# EAGLE design ActiveHeadphone2 (EAGLE 6.2)
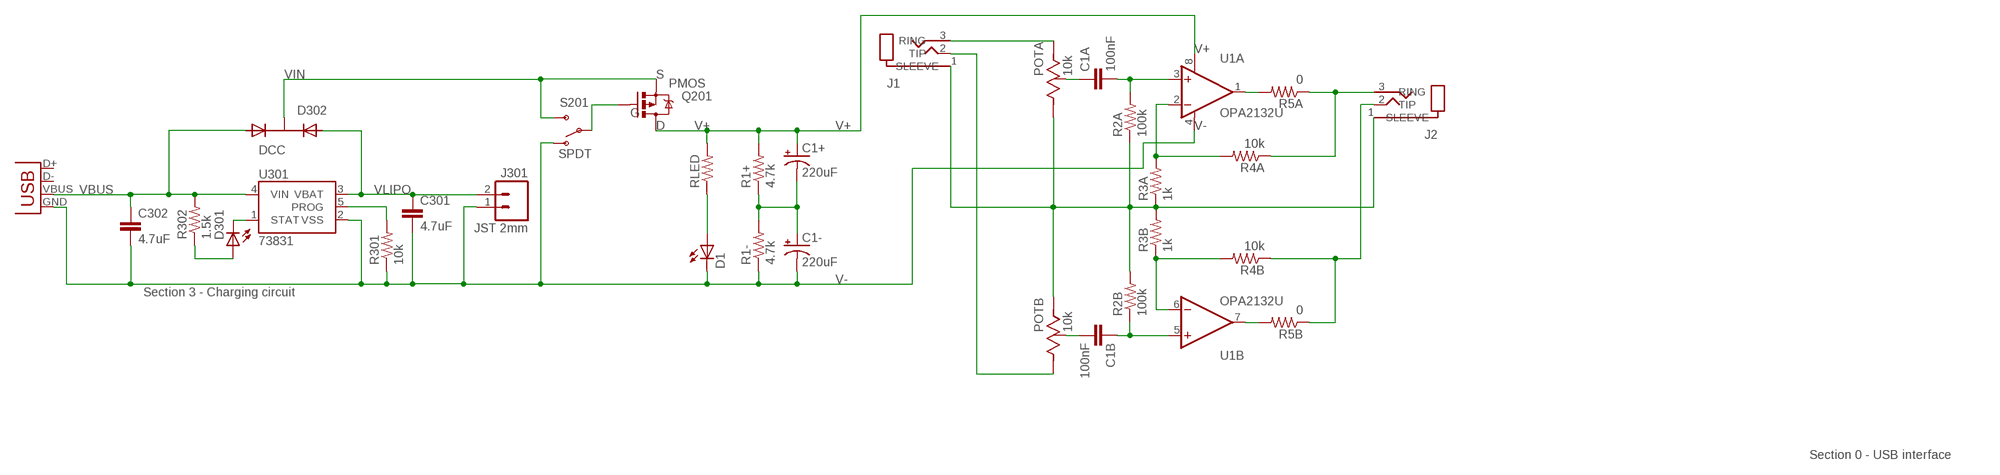
[diagram p0: schematic, sheet 1]

## Parts
C1+  220uF  CAP_POL7343  [EIA7343]
C1-  220uF  CAP_POL7343  [EIA7343]
C1A  100nF  CAP0603-CAP  [0603-CAP]
C1B  100nF  CAP0603-CAP  [0603-CAP]
C301  4.7uF  CAP0603-CAP  [0603-CAP]
C302  4.7uF  CAP0603-CAP  [0603-CAP]
D1  RED  LED0603  [LED-0603]
D301  RED  LED0603  [LED-0603]
D302  DCC  PMEG2005CT  [SOT-23-3]
J1  3.5mm  SJ1-3513-SMT  [SJ1-3513-SMT]
J2  3.5mm  SJ1-3513-SMT  [SJ1-3513-SMT]
J003  USBSMD  [USB-MINIB]
J301  JST 2mm  M02-JST-2MM-SMT  [JST-2-SMD]
POTA  10k  3352T  [3352T]
POTB  10k  3352T  [3352T]
Q201  PMOS  MOSFET-PCHANNELSMD  [SOT23-3]
R1+  4.7k  RESISTOR0603-RES  [0603-RES]
R1-  4.7k  RESISTOR0603-RES  [0603-RES]
R2A  100k  RESISTOR0603-RES  [0603-RES]
R2B  100k  RESISTOR0603-RES  [0603-RES]
R3A  1k  RESISTOR0603-RES  [0603-RES]
R3B  1k  RESISTOR0603-RES  [0603-RES]
R4A  10k  RESISTOR0603-RES  [0603-RES]
R4B  10k  RESISTOR0603-RES  [0603-RES]
R5A  0  RESISTOR0603-RES  [0603-RES]
R5B  0  RESISTOR0603-RES  [0603-RES]
R301  10k  RESISTOR0603-RES  [0603-RES]
R302  1.5k  RESISTOR0603-RES  [0603-RES]
RLED  RESISTOR0603-RES  [0603-RES]
S201  SPDT  SWITCH-SPSTSMD  [AYZ0202]
U1  OPA2132U  [SO08]
U301  73831  MCP73831  [SOT23-5]

## Nets
N$1: C1A.2 R2A.2 U1.3(A:+IN)
N$2: D1.A RLED.1
N$3: J2.3(RING) R4A.1 R5A.1
N$4: J1.3(RING) POTA.3(CW)
N$5: C1A.1 POTA.2(WIPER)
N$6: R5A.2 U1.1(A:OUT)
N$7: R3A.2 R4A.2 U1.2(A:-IN)
N$8: J1.2(TIP) POTB.1(CCW)
N$9: C1B.2 POTB.2(WIPER)
N$10: C1B.1 R2B.1 U1.5(B:+IN)
N$11: R3B.1 R4B.2 U1.6(B:-IN)
N$12: R5B.2 U1.7(B:OUT)
N$13: J2.2(TIP) R4B.1 R5B.1
N$14: R301.2 U301.5(PROG)
N$15: C1+.C(-) C1-.A(+) R1+.1 R1-.2
N$16: Q201.1(G) S201.2(P)
N$18: D301.A R302.1
N$19: D301.C U301.1(STAT)
V+: C1+.A(+) Q201.3(D) R1+.2 RLED.2 U1.8(A:V+)
V-: C1-.C(-) C301.2 C302.2 D1.C J003.GND J301.1 R1-.1 R301.1 S201.1(O) U1.4(A:V-) U301.2(VSS)
VBUS [power]: C302.1 D302.1(A1) J003.VBUS R302.2 U301.4(VIN)
VGND: J1.1(SLEEVE) J2.1(SLEEVE) POTA.1(CCW) POTB.3(CW) R2A.1 R2B.2 R3A.1 R3B.2
VIN: D302.3(K) Q201.2(S) S201.3(S)
VLIPO [power]: C301.1 D302.2(A2) J301.2 U301.3(VBAT)
Unconnected: J003.D+ J003.D-

## Notes on the sheet
- S
- G
- D
- Section 3 - Charging circuit
- Section 0 - USB interface

## Library data of the parts
C1+ C1- = SparkFun:CAP_POL: Capacitor Polarized These are standard SMD and PTH capacitors. Normally 10uF, 47uF, and 100uF in electrolytic and tantalum varieties. Always verify the external diameter of the through hole cap, it varies with capacity, voltage, and manufacturer. The EIA devices should be standard.; DIGIKEY: 399-5124-1-ND
C1A C1B C301 C302 = SparkFun:CAP: Capacitor Standard 0603 ceramic capacitor, and 0.1" leaded capacitor.
D1 D301 = SparkFun:LED: LEDs Standard schematic elements and footprints for 5mm, 3mm, 1206, and 0603 sized LEDs. 5mm - Spark Fun Electronics SKU : COM-00529 (and others)
D302 = KwanSystems:PMEG2005CT
J1 J2 = KwanSystems:SJ1-3513-SMT
J003 = SparkFun:USB: USB Connectors USB-B-PTH is fully proven SKU : PRT-00139 USB-miniB is fully proven SKU : PRT-00587 USB-A-PCB is untested. USB-A-H is throughly reviewed, but untested. Spark Fun Electronics SKU : PRT-00437 USB-B-SMT is throughly reviewed, but untested. Needs silkscreen touching up. USB-A-S has not been used/tested USB-MB-H has not been used/tested
J301 = SparkFun:M02: Header 2 Standard 2-pin 0.1" header. Use with straight break away headers (SKU : PRT-00116), right angle break away headers (PRT-00553), swiss pins (PRT-00743), machine pins (PRT-00117), and female headers (PRT-00115). Molex polarized connector foot print use with SKU : PRT-08233 with associated crimp pins and housings.
POTA POTB = KwanSystems:3352T
Q201 = SparkFun:MOSFET-PCHANNEL
R1+ R1- R2A R2B R3A R3B R4A R4B R5A R5B R301 R302 RLED = SparkFun:RESISTOR: Resistor Basic schematic elements and footprints for 0603, 1206, and PTH resistors.
S201 = SparkFun:SWITCH-SPST: SPST Switch Simple slide switch. Spark Fun Electronics SKU : COM-00102
U1 = burr-brown:OPA2132: High Speed FET-Input Operational Amplifiers< Product Folder:OPA2132; MF: TEXAS INSTRUMENTS; MPN: OPA2132U; OC_FARNELL: 1206934; OC_NEWARK: 80K6015
U301 = SparkFun:MCP73831: Microchip's MCP73831 Miniature single cell, fully integrated Li-Ion, Li-polymer charge management controller http://ww1.microchip.com/downloads/en/DeviceDoc/21984a.pdf

## Net classes
0 default: width 0.152 mm, drill 0.33 mm, clearance 0.152 mm
1 power: width 0.152 mm, drill 0.33 mm, clearance 0.152 mm to class 0, clearance 0.152 mm

## Board
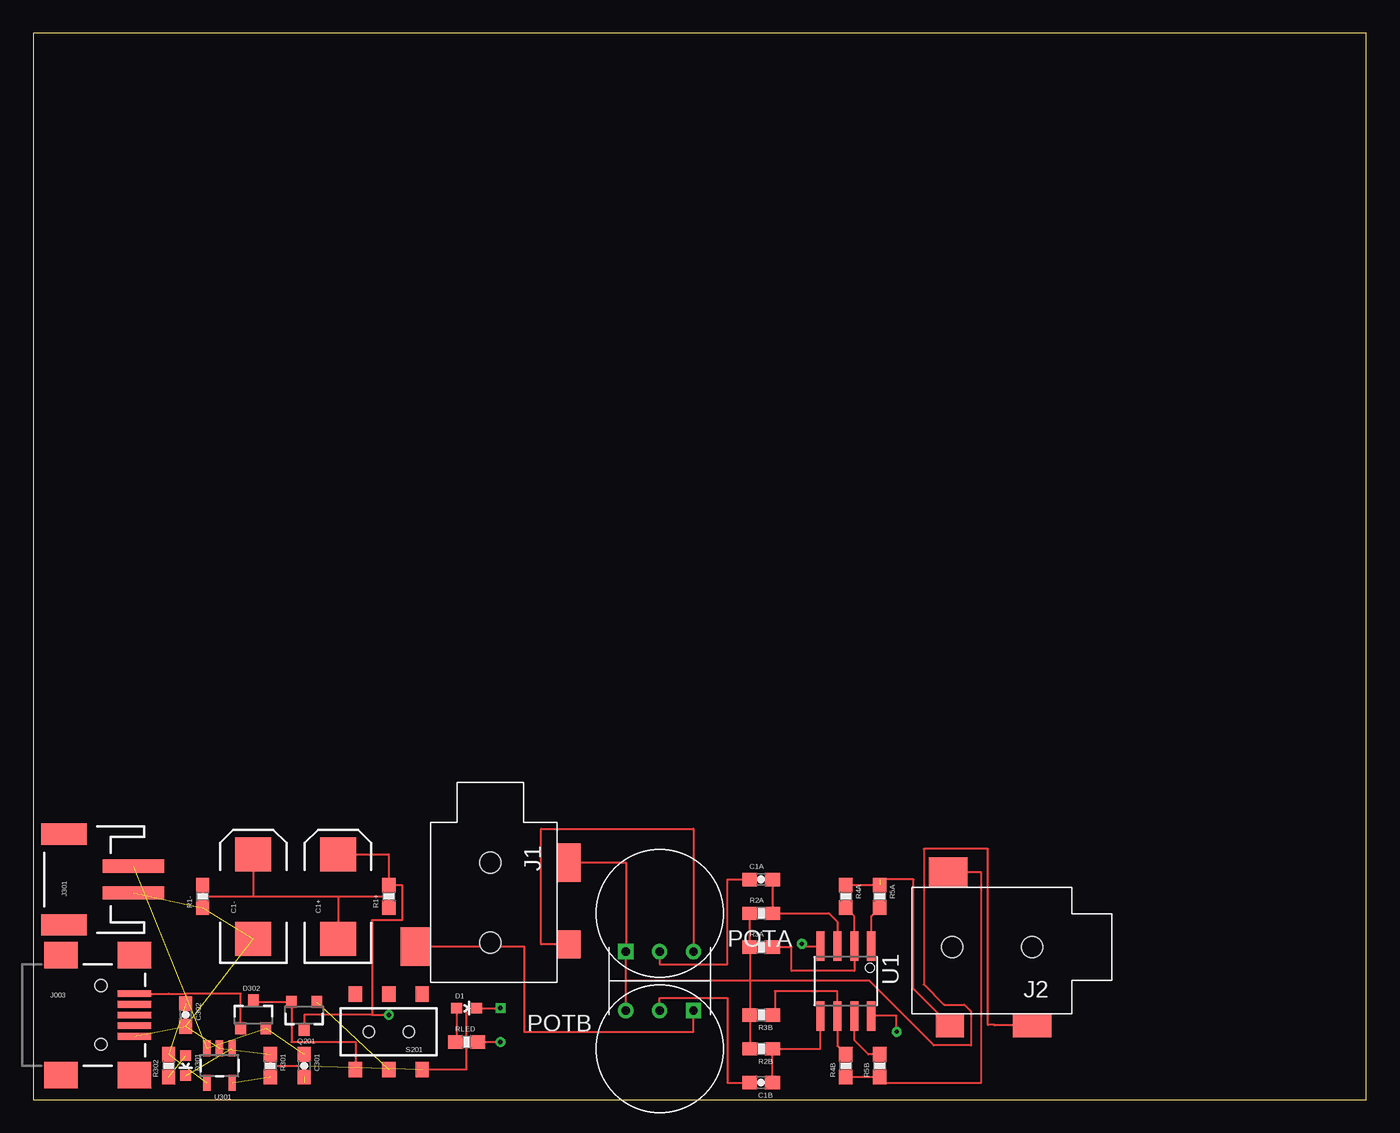
[diagram p1: board, top side]
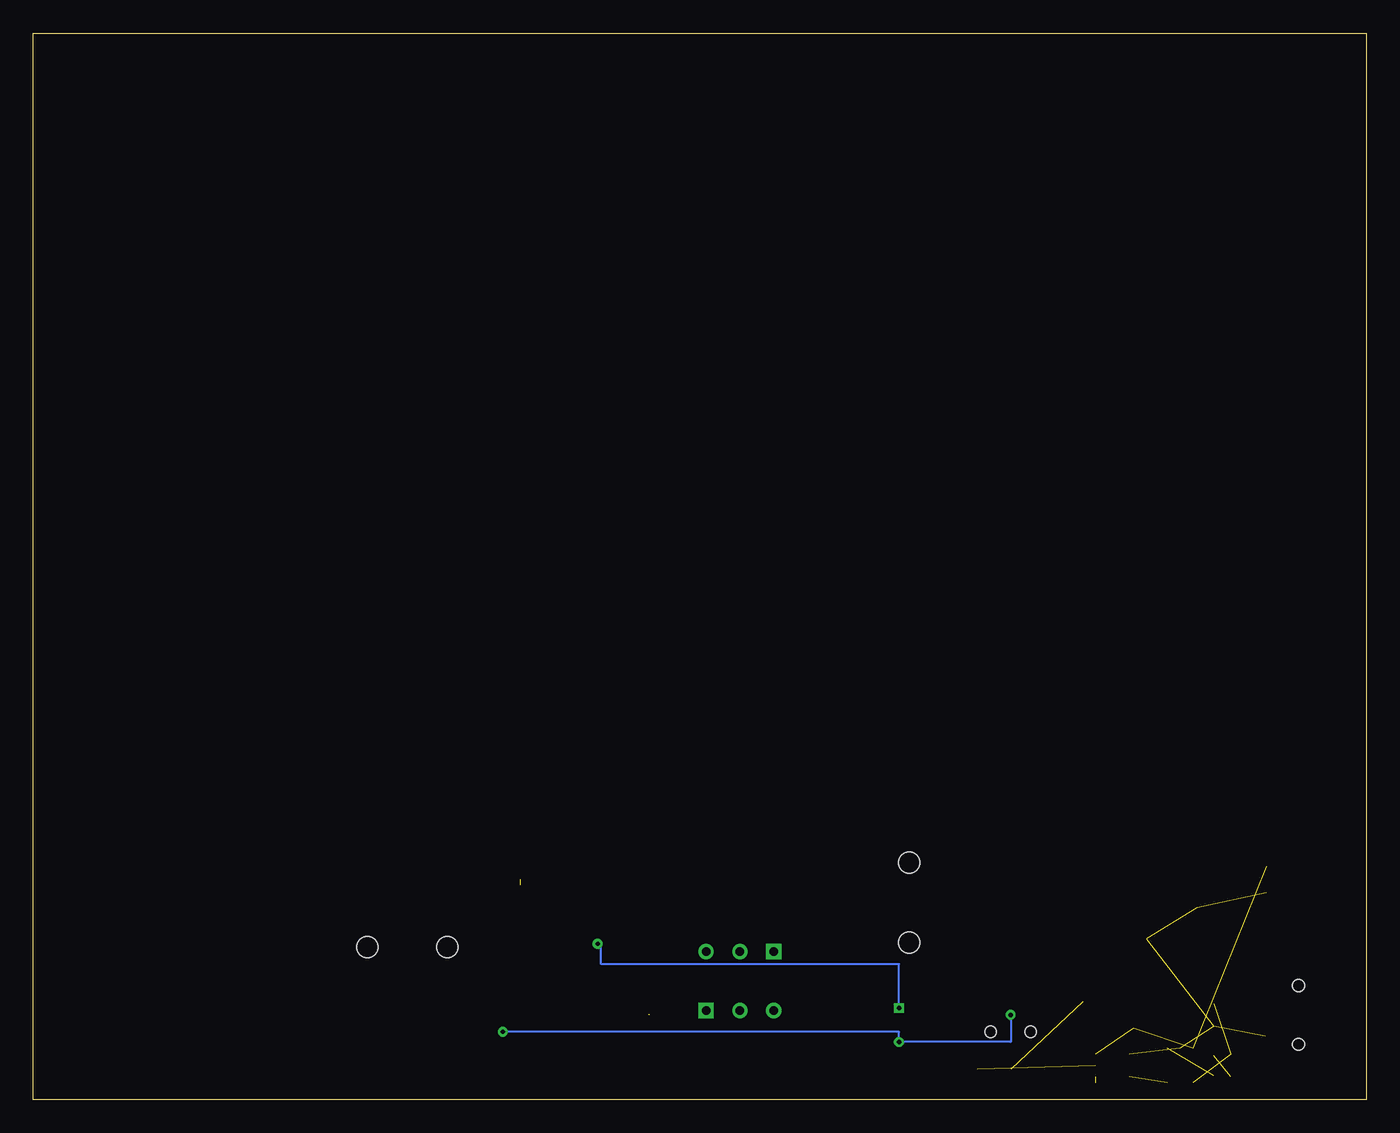
[diagram p2: board, bottom side, seen from below]

Size 100 x 80 mm. Coordinates in mm from the lower left corner, seen from the top.
Outline: 0,0 100,0 100,80 0,80 0,0
Copper layers (1*16): Top 0.035mm / dielectric 1.5mm / Bottom 0.035mm
Design rules: minimum track width 10mil, minimum drill 24mil, track to track 8mil, track to pad 8mil, pad to pad 8mil, via to via 8mil, smd to smd 8mil, copper to edge 40mil, drill to drill 8mil, minimum pad ring 10mil, minimum via ring 8mil, stop-mask expansion 4mil, vias tented up to drill 0mil, thermal gap 10mil

### Footprints (pad centres in the part's own frame; a part is rotated, then mirrored left to right if it is on the bottom)
EIA7343 = smd 2.55 x 2.7: A 3.17,0; C -3.17,0
0603-CAP = smd 1.1 x 1: 1 -0.85,0; 2 0.85,0
LED-0603 = smd 0.8 x 0.8: A 0,-0.75; C 0,0.75
SOT-23-3 = smd 0.9 x 0.8: 1 -1,0.95; 2 -1,-0.95; 3 1.1,0
SJ1-3513-SMT = smd 2.9 x 1.75: 1 0,5.875 | smd 2.9 x 2.25: 2 6.3,-5.625 | smd 2.1 x 1.75: 3 6.15,5.875 | hole 1.6: 0,0; 6,0
USB-MINIB = smd 2.5 x 0.5: D+ 2.5,0; D- 2.5,0.8; GND 2.5,-1.6; ID 2.5,-0.8; VBUS 2.5,1.6 | smd 2.5 x 2: MTN1 -3,4.5; MTN2 2.5,4.5; MTN3 -3,-4.5; MTN4 2.5,-4.5 | hole 0.9: 0,2.2; 0,-2.2
JST-2-SMD = smd 1 x 4.6: 1 -1,-3.7; 2 1,-3.7 | smd 1.6 x 3.4: NC1 -3.4,1.5; NC2 3.4,1.5
3352T = drill 0.635 square: 1 -2.54,-2.87 | drill 0.635: 2 0,-2.87; 3 2.54,-2.87
SOT23-3 = smd 0.8 x 0.9: 1 -0.95,-1; 2 0.95,-1; 3 0,1.1
0603-RES = smd 1.1 x 1: 1 -0.85,0; 2 0.85,0
AYZ0202 = smd 1 x 1.15: 1 -2.5,2.825; 2 0,2.825; 3 2.5,2.825; 4 -2.5,-2.825; 5 0,-2.825; 6 2.5,-2.825 | hole 0.85: 1.5,0; -1.5,0
SO08 = smd 0.61 x 2.21: 1 -1.905,-2.616; 2 -0.635,-2.616; 3 0.635,-2.616; 4 1.905,-2.616; 5 1.905,2.616; 6 0.635,2.616; 7 -0.635,2.616; 8 -1.905,2.616
SOT23-5 = smd 0.55 x 1.2: 1 -0.95,-1.3; 2 0,-1.3; 3 0.95,-1.3; 4 0.95,1.3; 5 -0.95,1.3

### Placement (x,y rotation side)
C1+  22.86,15.24 90 top
C1-  16.51,15.24 90 top
C1A  54.61,16.51 0 top
C1B  54.61,1.27 180 top
C301  20.32,2.54 270 top
C302  11.43,6.35 270 top
D1  32.51,6.86 270 top
D301  11.43,2.54 180 top
D302  16.51,6.35 90 top
J1  34.29,17.78 270 top
J2  74.93,11.43 180 top
J003  5.08,6.35 0 top
J301  3.81,16.51 90 top
POTA  46.99,13.97 0 top
POTB  46.99,3.81 180 top
Q201  20.32,6.35 180 top
R1+  26.67,15.24 90 top
R1-  12.7,15.24 90 top
R2A  54.61,13.97 0 top
R2B  54.61,3.81 180 top
R3A  54.61,11.43 0 top
R3B  54.61,6.35 180 top
R4A  60.96,15.24 270 top
R4B  60.96,2.54 90 top
R5A  63.5,15.24 270 top
R5B  63.5,2.54 90 top
R301  17.78,2.54 270 top
R302  10.16,2.54 90 top
RLED  32.51,4.32 0 top
S201  26.67,5.08 180 top
U1  60.96,8.89 180 top
U301  13.97,2.54 180 top

### Tracks (layer width: path | path; a pad name or v marks a point on that pad's centre or on a via)
N$1
  Top 0.152: C1A.2 R2A.2 59.69,13.97 60.33,13.34 U1.3
N$2
  Top 0.152: D1.A 31.76,4.32 RLED.1
N$3  (1 unrouted)
  Top 0.152: R4A.1 R5A.1 | J2.3 66.04,8.29 66.04,16.51 63.5,16.51
N$4
  Top 0.152: J1.3 38.1,11.63 38.1,20.32 49.53,20.32 POTA.3
N$5
  Top 0.152: POTA.2 46.99,10.16 52.07,10.16 52.07,16.51 C1A.1
N$6
  Top 0.152: U1.1 62.87,13.76 R5A.2
N$7
  Top 0.152: R4A.2 61.59,13.76 U1.2 61.59,9.65 56.9,9.65 56.9,11.43 R3A.2
N$8
  Top 0.152: J1.2 36.83,11.48 36.83,5.08 49.53,5.08 POTB.1
N$9
  Top 0.152: POTB.2 46.99,7.62 52.07,7.62 52.07,1.27 C1B.2
N$10
  Top 0.152: C1B.1 R2B.1 | R2B.1 55.88,3.81 | R2B.1 59.05,3.81 U1.5
N$11
  Top 0.152: R4B.2 60.33,4.03 U1.6 60.33,8.13 55.63,8.13 55.63,6.35 R3B.1
N$12
  Top 0.152: R5B.2 62.65,3.39 61.59,4.45 U1.7
N$13
  Top 0.152: R4B.1 R5B.1 63.5,1.27 71.12,1.27 71.12,17.05 J2.2
N$14  (1 unrouted)
N$15
  Top 0.152: C1-.A 16.51,15.24 | 16.51,15.24 22.86,15.24 | 22.86,15.24 C1+.C | 22.86,15.24 26.67,15.24 R1+.1 | R1-.2 12.7,15.24 16.51,15.24
N$16  (1 unrouted)
N$18  (1 unrouted)
N$19  (1 unrouted)
V+  (via drill 0.33)
  Top 0.152: C1+.A 26.67,18.41 R1+.2 27.69,16.09 27.69,13.46 25.4,13.46 25.4,6.35 | 25.4,6.35 20.32,6.35 Q201.3 | RLED.2 v35.05,4.32 | v64.77,5.08 64.77,6.27 U1.8 | 25.4,6.35 v26.67,6.35
  Bottom 0.152: v64.77,5.08 35.05,5.08 v35.05,4.32 26.67,4.32 v26.67,6.35
V-  (via drill 0.33)  (8 unrouted)
  Top 0.152: R301.1 17.78,2.54 20.32,2.54 20.32,1.27 | S201.1 32.48,2.25 32.51,2.29 32.51,6.86 D1.C v35.05,6.86 | v57.66,11.68 57.66,11.51 U1.4
  Bottom 0.152: v35.05,6.86 35.05,10.16 57.4,10.16 57.4,11.68 v57.66,11.68
VBUS  (2 unrouted)
  Top 0.152: J003.VBUS 10.16,7.95 11.43,7.95 | 11.43,7.95 C302.1 | D302.1 15.56,7.95 11.43,7.95
VGND  (1 unrouted)
  Top 0.152: POTB.3 44.45,8.89 | 44.45,8.89 POTA.1 44.45,17.78 J1.1 | 53.76,8.89 R3A.1 R2A.1 | 53.76,8.89 44.45,8.89 | 53.76,8.89 R3B.2 R2B.2 | J2.1 72.14,5.55 72.14,5.59 71.63,5.59 71.63,18.8 66.8,18.8 66.8,8.64 68.33,7.11 69.85,7.11 70.36,6.6 70.36,4.06 67.56,4.06 62.74,8.89 53.76,8.89 | 53.59,6.6 53.85,6.35
VIN
  Top 0.152: D302.3 16.51,7.35 Q201.2 19.37,4.32 24.17,4.32 S201.3
VLIPO  (3 unrouted)